# EAGLE design anet-esp8266-ext (EAGLE 6.1)
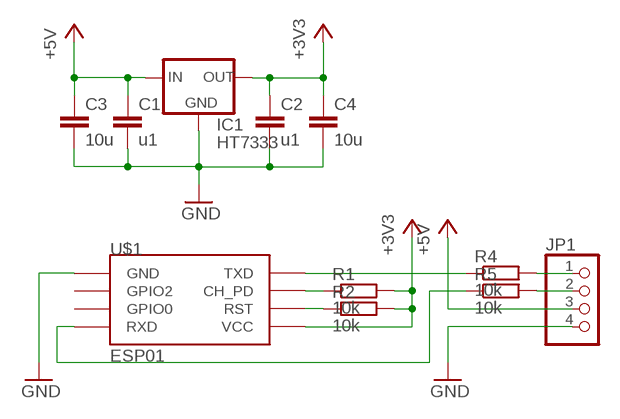
[diagram p0: schematic, sheet 1]

## Parts
C1  u1  C-EUC0805  [C0805]
C2  u1  C-EUC0805K  [C0805K]
C3  10u  C-EUC0805K  [C0805K]
C4  10u  C-EUC0805K  [C0805K]
IC1  HT7333  [SOT-89]
JP1  PINHD-1X4  [1X04]
R1  10k  R-EU_M0805  [M0805]
R2  10k  R-EU_M0805  [M0805]
R4  10k  R-EU_R0805  [R0805]
R5  10k  R-EU_M0805  [M0805]
U$1  ESP01  [ESP01]

## Nets
+3V3: C2.1 C4.1 IC1.1(OUT) R1.2 R2.2 U$1.VCC
+5V: C1.1 C3.1 IC1.3(IN) IC1.4(IN) JP1.3
GND: C1.2 C2.2 C3.2 C4.2 IC1.2(GND) JP1.4 U$1.GND
N$1: R1.1 U$1.CH_PD
N$2: JP1.1 R4.2
N$3: JP1.2 R5.2
N$4: R2.1 U$1.RST
RX: R5.1 U$1.RX(RXD)
TX: R4.1 U$1.TX(TXD)
Unconnected: U$1.GPIO0 U$1.GPIO2

## Library data of the parts
C1-C4 = rcl:C-EU: CAPACITOR, European symbol
IC1 = holtek2:HT73*
JP1 = pinhead:PINHD-1X4: PIN HEADER
R1 R2 R4 R5 = rcl:R-EU_: RESISTOR, European symbol
U$1 = esp8266modules:ESP01: ESP8266 Wifi module 01

## Board
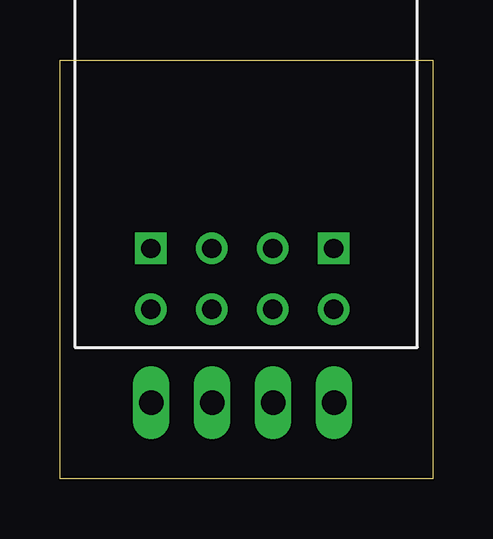
[diagram p1: board, top side]
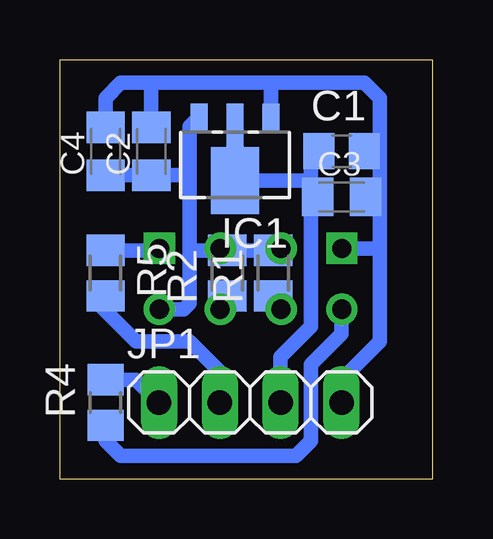
[diagram p2: board, bottom side, seen from below]

Size 15.56 x 17.46 mm. Coordinates in mm from the lower left corner, seen from the top.
Outline: 0,0 0,17.46 15.56,17.46 15.56,0 0,0
Copper layers (1*16): Top 0.035mm / dielectric 1.5mm / Bottom 0.035mm
Design rules: minimum track width 10mil, minimum drill 24mil, track to track 12mil, track to pad 12mil, pad to pad 12mil, via to via 12mil, smd to smd 10mil, copper to edge 12mil, drill to drill 12mil, minimum pad ring 10mil, minimum via ring 10mil, stop-mask expansion 4mil, vias tented up to drill 0mil, thermal gap 12mil

### Footprints (pad centres in the part's own frame; a part is rotated, then mirrored left to right if it is on the bottom)
C0805 = smd 1.3 x 1.5: 1 -0.95,0; 2 0.95,0
C0805K = smd 1.3 x 1.6: 1 -1,0; 2 1,0
SOT-89 = smd 0.7 x 1.1: 1 1.5,-2.385; 2 -1.5,-2.385 | smd 0.7 x 1.8: 3 0,-2.035 | smd 2 x 2.8: 4 0,0.265
1X04 = drill 1.016 long: 1 -3.81,0; 2 -1.27,0; 3 1.27,0; 4 3.81,0
M0805 = smd 1.3 x 1.6: 1 -0.95,0; 2 0.95,0
R0805 = smd 1.3 x 1.5: 1 -0.95,0; 2 0.95,0
ESP01 = drill 0.8: CH_PD -1.285,-8.178; GPIO0 1.255,-5.638; GPIO2 -1.285,-5.638; RST 1.255,-8.178; TX -3.825,-8.178; VCC 3.795,-8.178 | drill 0.8 square: GND -3.825,-5.638; RX 3.795,-5.638

### Placement (x,y rotation side)
C1  3.81,13.65 0 bottom
C2  11.75,13.65 90 bottom
C3  3.81,11.75 0 bottom
C4  13.65,13.65 90 bottom
IC1  8.26,12.7 180 bottom
JP1  7.62,3.17 0 bottom
R1  6.67,8.57 90 bottom
R2  8.57,8.57 90 bottom
R4  13.65,3.17 90 bottom
R5  13.65,8.57 270 bottom
U$1  7.62,15.24 0 top

### Tracks (layer width: path | path; a pad name or v marks a point on that pad's centre or on a via)
+3V3
  Bottom 0.61: U$1.VCC 10.4,7.06 10.16,7.3 10.16,9.52 | 9.76,15.01 IC1.1 10.16,14.68 10.16,12.7 | C4.1 C2.1 10.21,12.65 10.16,12.7 | 10.16,9.52 10.16,12.7 | R1.2 R2.2 10.16,9.52
+5V
  Bottom 0.61: JP1.3 6.35,5.08 5.08,6.35 5.08,11.75 | 5.08,11.75 5.08,12.38 | 5.08,12.38 5.08,13.33 C1.1 | 5.08,12.38 5.13,12.44 IC1.4 IC1.3 | C3.1 5.08,11.75
GND
  Bottom 0.61: JP1.4 3.81,4.13 2.22,5.71 2.22,9.53 | U$1.GND 2.3,9.6 2.22,9.53 | 2.22,9.53 2.22,11.75 | 2.22,11.75 2.22,13.65 | 2.22,13.65 2.22,15.88 2.86,16.51 6.67,16.51 | C1.2 2.22,13.65 | C3.2 2.22,11.75 | C4.2 13.65,15.88 13.02,16.51 11.75,16.51 | 11.75,16.51 6.67,16.51 | IC1.2 6.75,16.42 6.67,16.51 | C2.2 11.75,16.51
N$1
  Bottom 0.61: U$1.CH_PD 6.67,7.06 R1.1
N$2
  Bottom 0.61: R4.2 12.38,4.12 JP1.1
N$3
  Bottom 0.61: JP1.2 8.89,4.45 10.16,5.71 12.38,5.71 13.97,7.3 R5.2
N$4
  Bottom 0.61: U$1.RST 8.57,7.06 R2.1
RX
  Bottom 0.61: R5.1 11.49,9.52 U$1.RX
TX
  Bottom 0.61: R4.1 13.65,1.59 13.02,0.95 5.71,0.95 5.08,1.59 5.08,4.76 3.81,6.03 3.81,7.05 U$1.TX